# EAGLE design WS2811_Stepper (EAGLE 9.6.2)
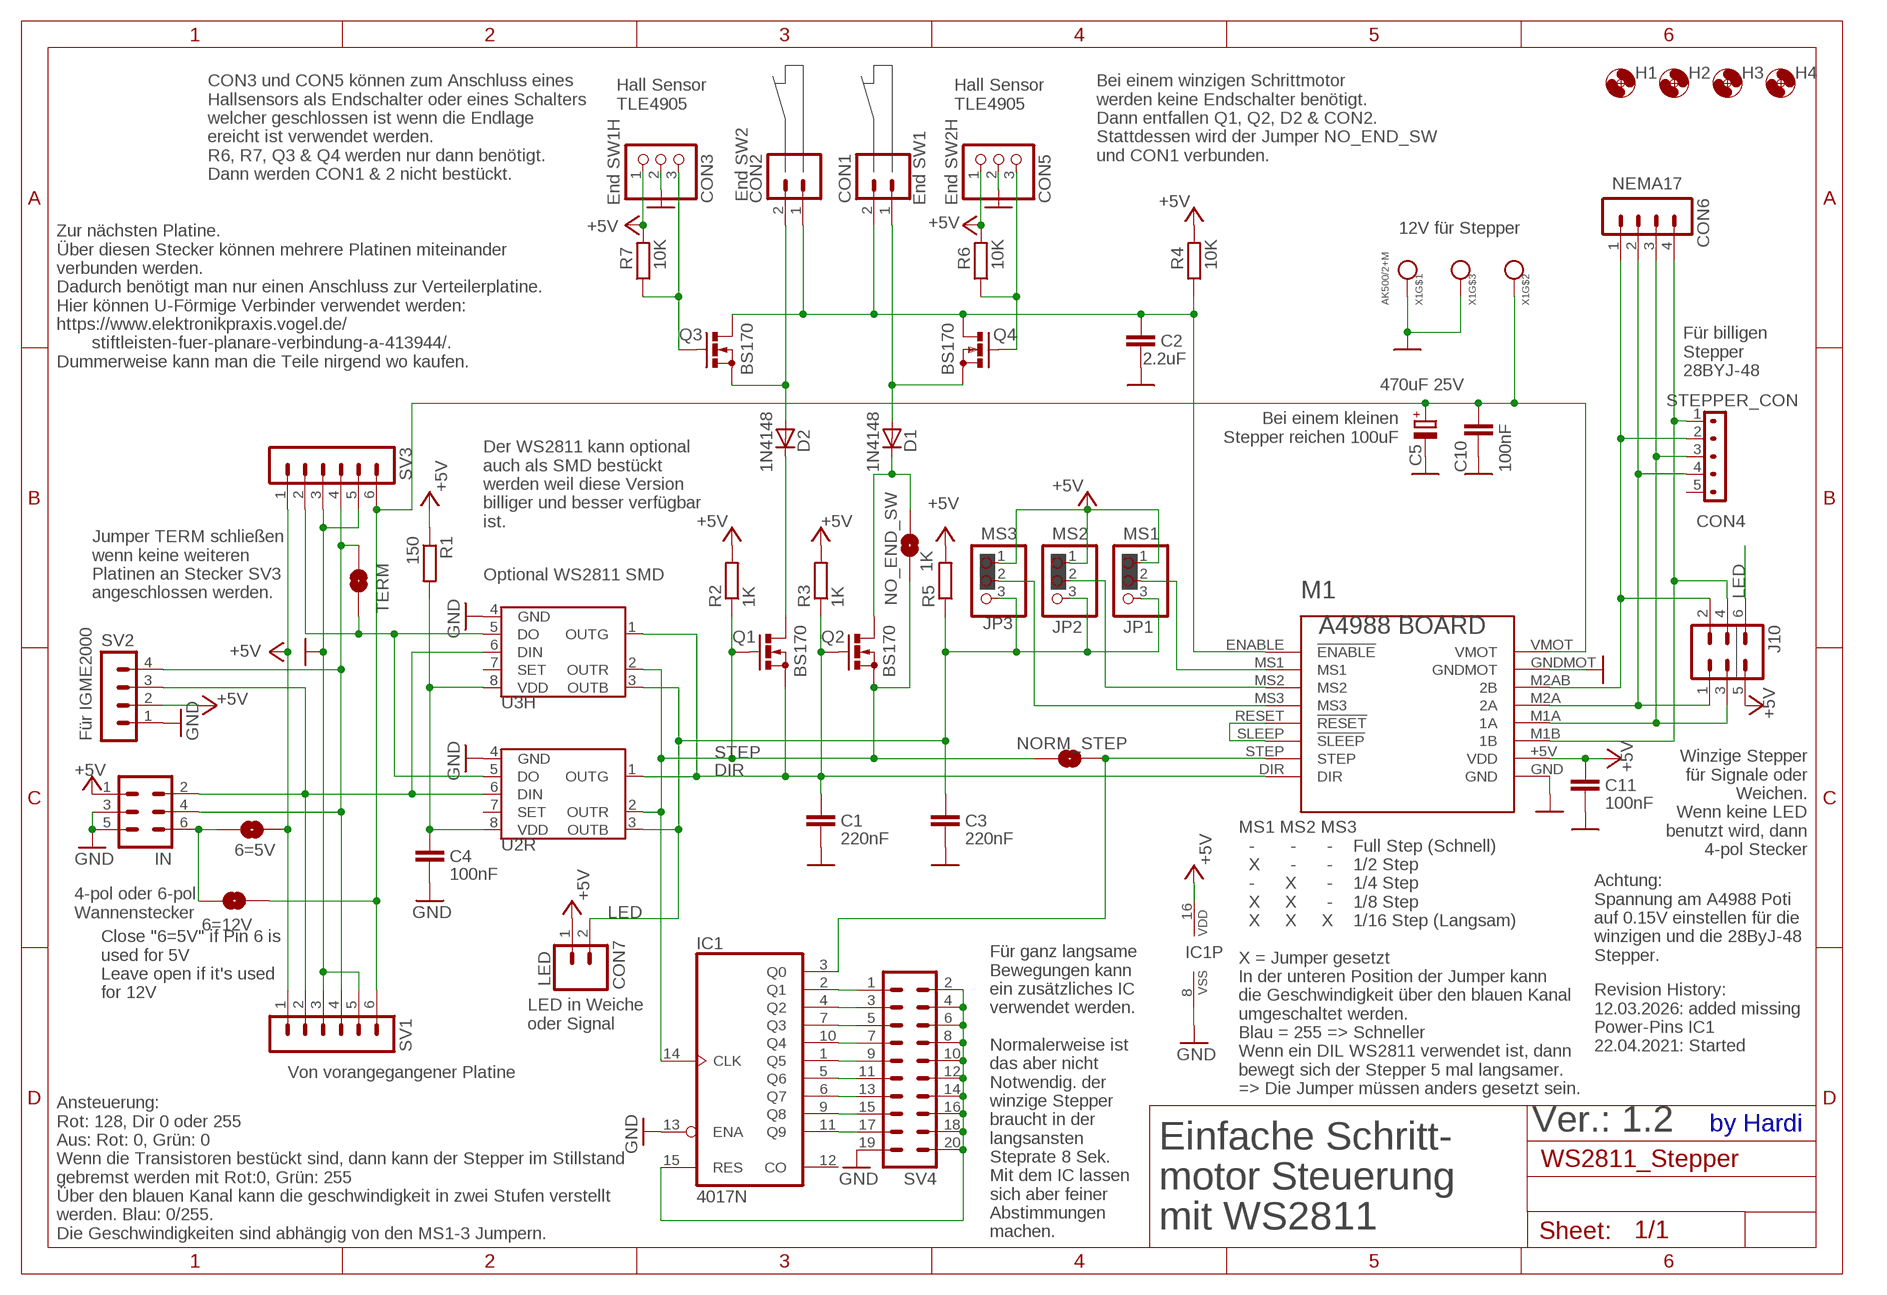
[diagram p0: schematic, sheet 1]

## Parts
6=5V  SOLDERJUMPERNO  [SJ_2S-NO]
6=12V  SOLDERJUMPERNO  [SJ_2S-NO]
C1  220nF  C-EU050-024X044  [C050-024X044]
C2  2.2uF  C-EU050-024X044  [C050-024X044]
C3  220nF  C-EU050-024X044  [C050-024X044]
C4  100nF  C-EU050-024X044  [C050-024X044]
C5  470uF 25V  CPOL-EUE5-10.5  [E5-10,5]
C10  100nF  C-EU050-024X044  [C050-024X044]
C11  100nF  C-EU050-024X044  [C050-024X044]
CON1  End SW1  M02PTH  [1X02]
CON2  End SW2  M02PTH  [1X02]
CON3  End SW1H  PINHD-1X3CB  [1X03-CLEANBIG]
CON4  STEPPER_CON  [STEPPER_CON]
CON5  End SW2H  PINHD-1X3CB  [1X03-CLEANBIG]
CON6  NEMA17  MA04-1  [MA04-1]
CON7  LED  M02PTH  [1X02]
D1  1N4148  1N4148DO35-7  [DO35-7]
D2  1N4148  1N4148DO35-7  [DO35-7]
H1  MOUNT-HOLE2.0  [2,0]
H2  MOUNT-HOLE2.0  [2,0]
H3  MOUNT-HOLE2.0  [2,0]
H4  MOUNT-HOLE2.0  [2,0]
IC1  4017N  [DIL16]
IN  ML6  [ML6]
J10  ML6  [ML6]
JP1  MS1  PINHD-1X3CB  [1X03-CLEANBIG]
JP2  MS2  PINHD-1X3CB  [1X03-CLEANBIG]
JP3  MS3  PINHD-1X3CB  [1X03-CLEANBIG]
M1  BOARD_A4988  [BOARD_A4988]
NO_END_SW  SOLDERJUMPERNO  [SJ_2S-NO]
NORM_STEP  SOLDERJUMPERNO  [SJ_2S-NO]
Q1  BS170  [SOT54E]
Q2  BS170  [SOT54E]
Q3  BS170  [SOT54E]
Q4  BS170  [SOT54E]
R1  150  RCL_R-EU_0204/7  [RCL_0204/7]
R2  1K  RCL_R-EU_0204/7  [RCL_0204/7]
R3  1K  RCL_R-EU_0204/7  [RCL_0204/7]
R4  10K  RCL_R-EU_0204/7  [RCL_0204/7]
R5  1K  RCL_R-EU_0204/7  [RCL_0204/7]
R6  10K  RCL_R-EU_0204/7  [RCL_0204/7]
R7  10K  RCL_R-EU_0204/7  [RCL_0204/7]
SV1  MA06-1  [MA06-1]
SV2  MA04-1  [MA04-1]
SV3  MA06-1  [MA06-1]
SV4  MA10-2  [MA10-2]
TERM  SOLDERJUMPERNO  [SJ_2S-NO]
U2R  WS2811  S3PO_MODUL_WS2811_SOUND_MP3-TF-16P_WS2811_AND_ATTINY_WS2811-ICTINY45-20-DIP  [S3PO_MODUL_WS2811_SOUND_MP3-TF-16P_WS2811_AND_ATTINY_WS2811_DIP08]
U3H  WS2811 SOT-8  S3PO_MODUL_WS2811_SOUND_MP3-TF-16P_WS2811_AND_ATTINY_WS2811-ICSOP8  [SOP8]
X1  AK500/2+M  [AK500/2+M]

## Nets
+5V: 6=5V.2 C11.1 CON3.1 CON5.1 CON7.1 IC1.16(VDD) IN.1 J10.5 JP1.1 JP2.1 JP3.1 M1.+5V(VDD) R1.1 R2.2 R3.2 R4.2 R5.2 R6.2 R7.2 SV1.1 SV2.2 SV3.1
DIR: C1.1 M1.DIR Q1.S Q2.G R3.1 U2R.1(OUTG) U3H.1(OUTG)
GND: C1.2 C2.2 C3.2 C4.2 C5.- C10.2 C11.2 CON3.2 CON5.2 IC1.8(VSS) IC1.13(ENA) IN.3 IN.5 M1.GND M1.GNDMOT SV1.3 SV1.5 SV2.1 SV3.3 SV3.5 SV4.19 U2R.4(GND) U3H.4(GND) X1.1 X1.M
LED: C3.1 CON7.2 J10.6 JP1.3 JP2.3 JP3.3 R5.1 U2R.3(OUTB) U3H.3(OUTB)
M1A: CON4.3 CON6.3 J10.3 M1.M1A(1A)
M1B: CON4.1 CON6.4 J10.4 M1.M1B(1B)
M2A: CON4.4 CON6.2 J10.1 M1.M2A(2A)
M2B: CON4.2 CON6.1 J10.2 M1.M2AB(2B)
N$1: M1.RESET(!RESET) M1.SLEEP(!SLEEP)
N$2: IN.2 SV1.2 SV2.3 U2R.6(DIN) U3H.6(DIN)
N$3: SV3.2 TERM.2 U2R.5(DO) U3H.5(DO)
N$4: IN.4 SV1.4 SV2.4 SV3.4 TERM.1
N$5: C4.1 R1.2 U2R.8(VDD) U3H.8(VDD)
N$6: C2.1 CON1.2 CON2.1 M1.ENABLE(!ENABLE) Q3.D Q4.D R4.1
N$8: CON1.1 D1.A Q4.S
N$9: CON2.2 D2.A Q3.S
N$10: CON5.3 Q4.G R6.1
N$11: D2.C Q1.D
N$13: D1.C NO_END_SW.1 Q2.D
N$14: JP2.2 M1.MS2
N$15: 6=5V.1 6=12V.2 IN.6
N$16: CON3.3 Q3.G R7.1
N$18: IC1.2(Q1) SV4.1
N$19: IC1.4(Q2) SV4.3
N$20: IC1.7(Q3) SV4.5
N$21: IC1.10(Q4) SV4.7
N$22: JP1.2 M1.MS1
N$23: IC1.1(Q5) SV4.9
N$24: IC1.5(Q6) SV4.11
N$25: IC1.6(Q7) SV4.13
N$26: IC1.9(Q8) SV4.15
N$27: JP3.2 M1.MS3
N$28: IC1.11(Q9) SV4.17
N$29: IC1.15(RES) SV4.2 SV4.4 SV4.6 SV4.8 SV4.10 SV4.12 SV4.14 SV4.16 SV4.18 SV4.20
N$33: IC1.3(Q0) M1.STEP NORM_STEP.2
STEP: IC1.14(CLK) NO_END_SW.2 NORM_STEP.1 Q1.G Q2.S R2.1 U2R.2(OUTR) U3H.2(OUTR)
VCC2: 6=12V.1 C5.+ C10.1 M1.VMOT SV1.6 SV3.6 X1.2
Unconnected: CON4.5 IC1.12(CO) U2R.7(SET) U3H.7(SET)

## Notes on the sheet
- CON3 und CON5 können zum Anschluss eines 
  Hallsensors als Endschalter oder eines Schalters
  welcher geschlossen ist wenn die Endlage
  ereicht ist verwendet werden. 
  R6, R7, Q3 & Q4 werden nur dann benötigt.
  Dann werden CON1 & 2 nicht bestückt.
- Bei einem winzigen Schrittmotor
  werden keine Endschalter benötigt.
  Dann entfallen Q1, Q2, D2 & CON2.
  Stattdessen wird der Jumper NO_END_SW
  und CON1 verbunden.
- Hall Sensor
  TLE4905
- Hall Sensor
  TLE4905
- 12V für Stepper
- Zur nächsten Platine. 
  Über diesen Stecker können mehrere Platinen miteinander
  verbunden werden.
  Dadurch benötigt man nur einen Anschluss zur Verteilerplatine.
  Hier können U-Förmige Verbinder verwendet werden: 
  https://www.elektronikpraxis.vogel.de/
         stiftleisten-fuer-planare-verbindung-a-413944/.
  Dummerweise kann man die Teile nirgend wo kaufen.
- Für billigen
  Stepper
  28BYJ-48
- Bei einem kleinen
  Stepper reichen 100uF
- Der WS2811 kann optional
  auch als SMD bestückt
  werden weil diese Version
  billiger und besser verfügbar
  ist.
- Optional WS2811 SMD
- Jumper TERM schließen 
  wenn keine weiteren
  Platinen an Stecker SV3 
  angeschlossen werden.
- Für IGME2000
- Winzige Stepper
  für Signale oder
  Weichen.
  Wenn keine LED
  benutzt wird, dann
  4-pol Stecker
- MS1 MS2 MS3
    -       -      -    Full Step (Schnell)
    X      -      -    1/2 Step
    -      X      -    1/4 Step
    X     X      -    1/8 Step
    X     X     X    1/16 Step (Langsam)
  
  X = Jumper gesetzt
  In der unteren Position der Jumper kann
  die Geschwindigkeit über den blauen Kanal
  umgeschaltet werden.
  Blau = 255 => Schneller
  Wenn ein DIL WS2811 verwendet ist, dann
  bewegt sich der Stepper 5 mal langsamer. 
  => Die Jumper müssen anders gesetzt sein.
- Achtung:
  Spannung am A4988 Poti
  auf 0.15V einstellen für die
  winzigen und die 28ByJ-48
  Stepper.
- 4-pol oder 6-pol 
  Wannenstecker
- Für ganz langsame
  Bewegungen kann 
  ein zusätzliches IC
  verwendet werden.
  
  Normalerweise ist
  das aber nicht 
  Notwendig. der 
  winzige Stepper
  braucht in der
  langsansten 
  Steprate 8 Sek.
  Mit dem IC lassen
  sich aber feiner
  Abstimmungen 
  machen.
- Close "6=5V" if Pin 6 is
  used for 5V
  Leave open if it's used 
  for 12V
- LED in Weiche
  oder Signal
- Revision History:
  12.03.2026: added missing 
  Power-Pins IC1
  22.04.2021: Started
- Von vorangegangener Platine
- Ansteuerung: 
  Rot: 128, Dir 0 oder 255
  Aus: Rot: 0, Grün: 0
  Wenn die Transistoren bestückt sind, dann kann der Stepper im Stillstand
  gebremst werden mit Rot:0, Grün: 255
  Über den blauen Kanal kann die geschwindigkeit in zwei Stufen verstellt
  werden. Blau: 0/255.
  Die Geschwindigkeiten sind abhängig von den MS1-3 Jumpern.
- Ver.: 1.2 | by Hardi
- Einfache Schritt-
  motor Steuerung
  mit WS2811

## Library data of the parts
6=5V 6=12V NO_END_SW NORM_STEP TERM = SparkFun-Retired:SOLDERJUMPER: Solder Jumper Standard SMD solder jumper. Used to automate production. Two varients : Normally Open and Normally Closed are the same, but have different paste layers. NC will have a large amount of paste and should jumper during reflow.
C1-C4 C10 C11 = resistor:C-EU: CAPACITOR, European symbol
C5 = resistor:CPOL-EU: POLARIZED CAPACITOR, European symbol
CON1 CON2 CON7 = SparkFun-Connectors:M02: Standard 2-pin 0.1" header. Use with - straight break away headers ( PRT-00116) - right angle break away headers (PRT-00553) - swiss pins (PRT-00743) - machine pins (PRT-00117) - female headers (PRT-00115) Molex polarized connector foot print use with: PRT-08233 with associated crimp pins and housings. 2.54_SCREWTERM for use with PRT-10571. 3.5mm Screw Terminal footprints for PRT-08084 5mm Screw Terminal footprints for use with PRT-08432
CON3 CON5 JP1-JP3 = adafruit:PINHD-1X3: PIN HEADER
CON4 = Connectors_Inline3_7:STEPPER_CON
CON6 SV2 = con-lstb:MA04-1: PIN HEADER; OC_FARNELL: unknown; OC_NEWARK: unknown
D1 D2 = diode:1N4148: DIODE high speed (Philips)
H1-H4 = holes:MOUNT-HOLE: MOUNTING HOLE with drill center marker
IC1 = 40xx:4017: COUNTER/DIVIDER
IN J10 = con-harting-ml:ML6: HARTING; OC_FARNELL: unknown; OC_NEWARK: unknown
M1 = Clean-Kong:BOARD_A4988
Q1-Q4 = transistor-small-signal:BS170: N-CHANNEL MOS FET
R1-R7 = Sound_MP3-TF-16P_and_WS2811:RCL_R-EU_: RESISTOR, European symbol; SPICEPREFIX: R
SV1 SV3 = con-lstb:MA06-1: PIN HEADER; OC_FARNELL: unknown; OC_NEWARK: unknown
SV4 = con-lstb:MA10-2: PIN HEADER; OC_FARNELL: unknown; OC_NEWARK: unknown
U2R = S3PO_Modul_WS2811:S3PO_MODUL_WS2811_SOUND_MP3-TF-16P_WS2811_AND_ATTINY_WS2811-IC: Die Pin Nummern für R und G sind getauscht damit sie gleich angesteuert werden wie die WS2812. Der Daten Strom der WS2811 ist RGB, Beim WS2812 ist es aber GRB.; PROD_ID: IC-09439; VALUE: TINY45-20-DIP
U3H = S3PO_Modul_WS2811:S3PO_MODUL_WS2811_SOUND_MP3-TF-16P_WS2811_AND_ATTINY_WS2811-IC: Die Pin Nummern für R und G sind getauscht damit sie gleich angesteuert werden wie die WS2812. Der Daten Strom der WS2811 ist RGB, Beim WS2812 ist es aber GRB.
X1 = Arduino_fuer_LEDs_DCC_2:AK500/2+M

## Board
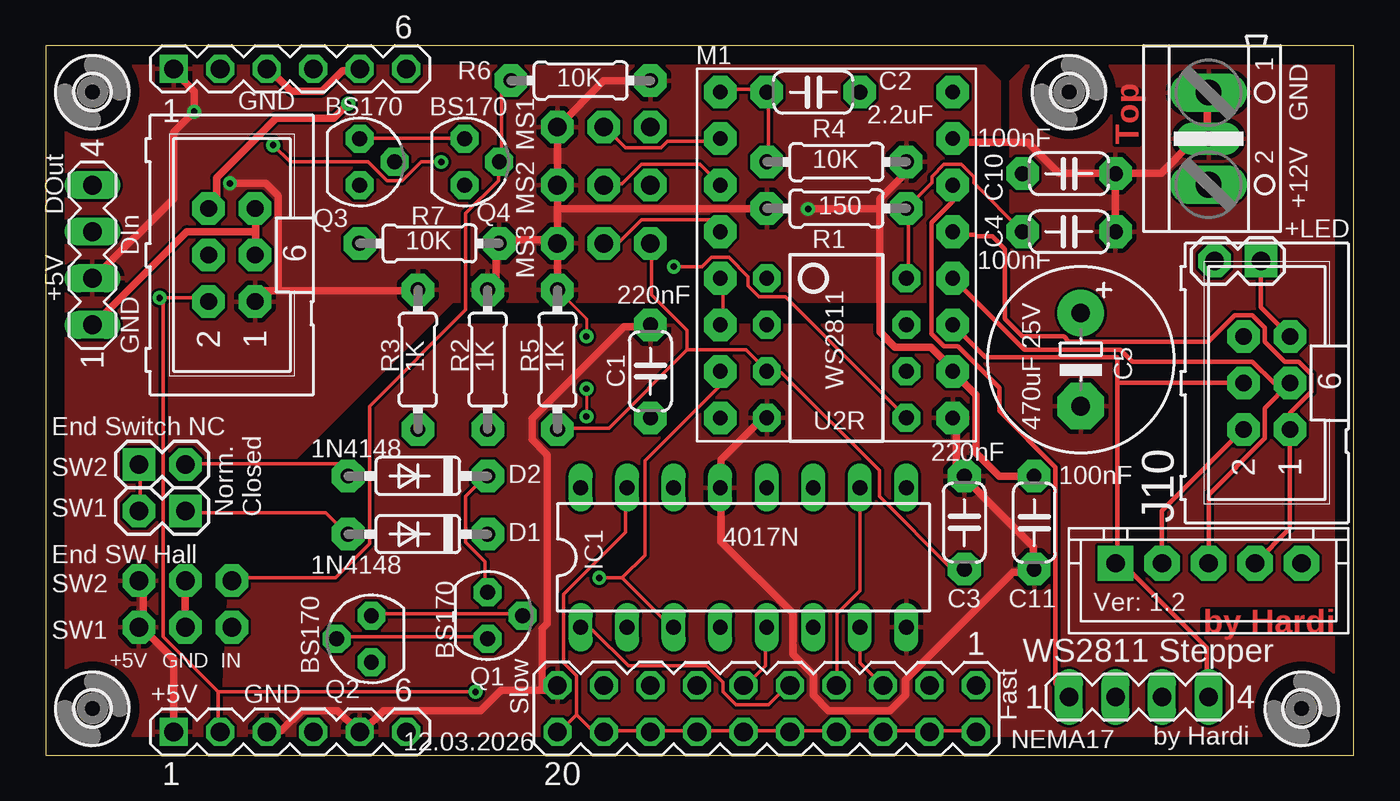
[diagram p1: board, top side]
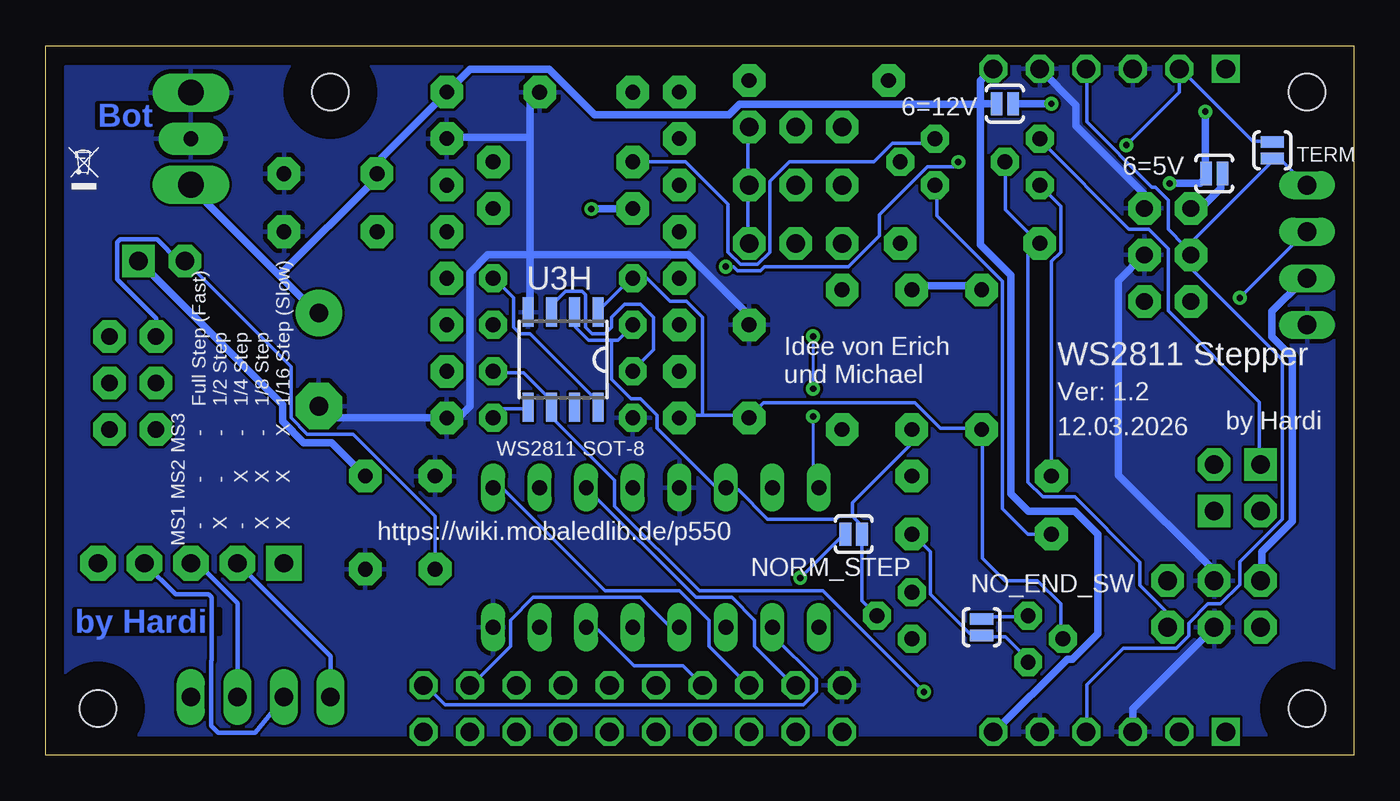
[diagram p2: board, bottom side, seen from below]

Size 71.42 x 38.73 mm. Coordinates in mm from the lower left corner, seen from the top.
Outline: 0,0 71.42,0 71.42,38.73 0,38.73 0,0
Copper layers (1*16): Top 0.035mm / dielectric 1.5mm / Bottom 0.035mm
Design rules "default *": minimum track width 6mil, minimum drill 0.35mm, track to track 6mil, track to pad 6mil, pad to pad 6mil, via to via 6mil, smd to smd 6mil, copper to edge 40mil, drill to drill 6mil, minimum pad ring 10mil, minimum via ring 8mil, stop-mask expansion 4mil, vias tented up to drill 14mil, thermal gap 10mil

### Footprints (pad centres in the part's own frame; a part is rotated, then mirrored left to right if it is on the bottom)
SJ_2S-NO = smd 0.635 x 1.27: 1 -0.45,0; 2 0.45,0
C050-024X044 = drill 0.813 pad 1.778 octagon: 1 -2.54,0; 2 2.54,0
E5-10,5 = drill 1.016 pad 2.54: + -2.54,0 | drill 1.016 pad 2.54 octagon: - 2.54,0
1X02 = drill 1.016 pad 1.778 square: 1 0,0 | drill 1.016 pad 1.778 octagon: 2 2.54,0
1X03-CLEANBIG = drill 1.016 pad 1.778 octagon: 1 -2.54,0; 2 0,0; 3 2.54,0
STEPPER_CON = drill 1 pad 1.93 square: 1 0,0 | drill 1 pad 1.93 octagon: 2 2.54,0; 3 5.08,0; 4 7.62,0; 5 10.16,0
MA04-1 = drill 1.016 long: 1 -3.81,0; 2 -1.27,0; 3 1.27,0; 4 3.81,0
DO35-7 = drill 0.813 pad 1.778 octagon: A 3.81,0; C -3.81,0
2,0 = hole 2: 0,0
DIL16 = drill 0.813 long: 1 -8.89,-3.81; 2 -6.35,-3.81; 3 -3.81,-3.81; 4 -1.27,-3.81; 5 1.27,-3.81; 6 3.81,-3.81; 7 6.35,-3.81; 8 8.89,-3.81; 9 8.89,3.81; 10 6.35,3.81; 11 3.81,3.81; 12 1.27,3.81; 13 -1.27,3.81; 14 -3.81,3.81; 15 -6.35,3.81; 16 -8.89,3.81
ML6 = drill 0.914 pad 1.778 octagon: 1 -2.54,-1.27; 2 -2.54,1.27; 3 0,-1.27; 4 0,1.27; 5 2.54,-1.27; 6 2.54,1.27
BOARD_A4988 = drill 0.8 pad 1.778 octagon: +5V 1.27,16.51; DIR 13.97,19.05; ENABLE 13.97,1.27; GND 1.27,19.05; GNDMOT 1.27,3.81; M1A 1.27,11.43; M1B 1.27,13.97; M2A 1.27,8.89; M2AB 1.27,6.35; MS1 13.97,3.81; MS2 13.97,6.35; MS3 13.97,8.89; RESET 13.97,11.43; SLEEP 13.97,13.97; STEP 13.97,16.51; VMOT 1.27,1.27
SOT54E = drill 0.813 pad 1.524 octagon: D -1.27,0; G 0,1.905; S 1.27,0
RCL_0204/7 = drill 0.813 pad 1.778 octagon: 1 -3.81,0; 2 3.81,0
MA06-1 = drill 1.016 pad 1.524 square: 1 -6.35,0 | drill 1.016 pad 1.524 octagon: 2 -3.81,0; 3 -1.27,0; 4 1.27,0; 5 3.81,0; 6 6.35,0
MA10-2 = drill 1.016 octagon: 1 -11.43,-1.27; 2 -11.43,1.27; 3 -8.89,-1.27; 4 -8.89,1.27; 5 -6.35,-1.27; 6 -6.35,1.27; 7 -3.81,-1.27; 8 -3.81,1.27; 9 -1.27,-1.27; 10 -1.27,1.27; 11 1.27,-1.27; 12 1.27,1.27; 13 3.81,-1.27; 14 3.81,1.27; 15 6.35,-1.27; 16 6.35,1.27; 17 8.89,-1.27; 18 8.89,1.27; 19 11.43,-1.27; 20 11.43,1.27
S3PO_MODUL_WS2811_SOUND_MP3-TF-16P_WS2811_AND_ATTINY_WS2811_DIP08 = drill 0.813 pad 1.524 octagon: 1 -3.81,-3.81; 2 -1.27,-3.81; 3 1.27,-3.81; 4 3.81,-3.81; 5 3.81,3.81; 6 1.27,3.81; 7 -1.27,3.81; 8 -3.81,3.81
SOP8 = smd 0.6 x 1.6: 1 -1.905,-2.6; 2 -0.635,-2.6; 3 0.635,-2.6; 4 1.905,-2.6; 5 1.905,2.6; 6 0.635,2.6; 7 -0.635,2.6; 8 -1.905,2.6
AK500/2+M = drill 1.397 long: 1 -2.515,0; 2 2.515,0 | drill 0.813 pad 1.778 long: M 0,0

### Placement (x,y rotation side)
6=5V  7.62,31.75 180 bottom
6=12V  19.05,35.56 0 bottom
C1  33.02,20.95 90 top
C2  41.91,36.2 0 top
C3  50.16,12.7 90 top
C4  55.88,28.57 0 top
C5  56.52,21.59 270 top
C10  55.88,31.75 0 top
C11  53.98,12.7 270 top
CON1  7.62,13.34 180 top
CON2  5.08,15.88 0 top
CON3  7.62,6.99 0 top
CON4  58.42,10.48 0 top
CON5  7.62,9.53 0 top
CON6  59.69,3.17 0 top
CON7  66.36,26.99 180 top
D1  20.32,12.06 180 top
D2  20.32,15.24 180 top
H1  68.58,2.54 0 top
H2  2.54,36.2 0 top
H3  2.54,2.54 0 top
H4  55.88,36.2 0 top
IC1  38.1,10.79 0 top
IN  10.16,27.3 90 top
J10  66.67,20.32 90 top
JP1  30.48,34.29 0 top
JP2  30.48,31.11 0 top
JP3  30.48,27.94 0 top
M1  50.8,37.47 180 top
NO_END_SW  20.32,6.99 90 bottom
NORM_STEP  27.3,12.06 180 bottom
Q1  24.13,7.62 270 top
Q2  17.78,6.35 90 top
Q3  17.14,32.38 270 top
Q4  22.86,32.38 270 top
R1  43.18,29.84 0 top
R2  24.13,21.59 90 top
R3  20.32,21.59 90 top
R4  43.18,32.38 0 top
R5  27.94,21.59 90 top
R6  29.21,36.83 0 top
R7  20.95,27.94 0 top
SV1  13.34,1.27 0 top
SV2  2.54,27.3 90 top
SV3  13.34,37.47 0 top
SV4  39.37,2.54 180 top
TERM  4.45,33.02 90 bottom
U2R  43.18,22.23 270 top
U3H  43.18,21.59 180 bottom
X1  63.5,33.66 270 top

### Tracks (layer width: path | path; a pad name or v marks a point on that pad's centre or on a via)
+5V  (via drill 0.35)
  Top 0.152: R5.2 29.53,23.81 v29.53,22.86 | v29.53,20 v29.53,18.49
  Top 0.254: J10.5 66.36,24.45 CON7.1
  Top 0.406: SV1.1 6.99,5.23 5.31,6.91 CON3.1 5.31,7.19 5.31,9.42 CON5.1 | SV3.1 6.99,37.36 8.1,36.25 v8.1,35.13 6.99,34.01 6.99,30.38 2.79,26.19 SV2.2 | v10.06,31.22 12.01,31.22 12.7,30.53 12.7,25.35 | 45.54,29.82 45.54,23.11 46.38,22.28 48.34,22.28 49.45,21.16 M1.+5V 50.8,19.68 50.8,16.51 52.07,15.24 C11.1 | 45.54,29.82 45.54,30.38 46.94,31.77 46.94,32.33 R4.2 | R2.2 24.31,25.63 24.59,25.91 24.59,27.86 R7.2 24.87,28.14 27.94,28.14 | R5.2 JP3.1 27.94,28.14 | 27.94,28.14 27.94,29.82 | 27.94,29.82 JP2.1 JP1.1 30.45,36.8 32.97,36.8 R6.2 | 27.94,29.82 39.12,29.82 R1.1 | v41.63,29.82 45.54,29.82 | R3.2 20.12,25.35 12.7,25.35 | 12.7,25.35 12.01,25.35 IN.1
  Bottom 0.152: v29.53,22.86 v29.53,20 | v29.53,18.49 29.53,14.92 IC1.16
  Bottom 0.406: v8.1,35.13 8.1,31.77 6=5V.2 8.1,31.5 8.38,31.22 v10.06,31.22 | CON5.1 5.03,9.7 5.03,11.1 3.35,12.78 3.35,21.72 4.47,22.84 4.47,24.23 2.79,25.91 SV2.2 | R3.2 20.4,25.63 24.03,25.63 R2.2 | v41.63,29.82 39.4,29.82 R1.1 | C11.1 55.8,17.07 57.34,17.07 58.5,18.23 58.5,19.13 CON7.1
  pour Top: 0,0 0,38.1 50.8,38.1 52.07,36.83 52.07,26.67 50.16,24.77 22.23,24.77 8.89,11.43 8.89,0
DIR
  Top 0.203: Q2.G 16,6.48 24,6.48 Q1.S
  Bottom 0.203: U3H.1 41.25,24.26 39.47,26.04 U2R.1 38.58,26.04 37.34,24.79 36.45,24.79 35.56,23.9 35.56,18.57 | 35.56,18.57 33.07,18.57 C1.1 32.89,18.57 32.22,19.24 23.96,19.24 22.58,17.86 20.45,17.86 R3.1 20.27,17.68 20.27,10.74 19.05,9.53 17.27,9.53 16,8.26 16,6.48 Q2.G | 35.56,18.57 36.8,18.57 M1.DIR
GND
  Top 0.406: 11.46,28.57 11.46,29.82 IN.5 | 11.46,28.57 11.46,27.3 IN.3 | SV2.1 2.79,23.67 7.7,28.57 11.46,28.57 | SV3.5 17.04,37.36 16.2,37.36 15.09,36.25 13.41,36.25 12.29,37.36 SV3.3 | U2R.4 39.12,18.36 36.88,16.13 36.88,14.73 IC1.13 36.88,14.45 36.88,11.66 40.79,7.75 40.79,5.51 41.91,4.39 41.91,3.28 42.75,2.44 46.1,2.44 46.94,3.28 46.94,4.12 52.81,9.98 53.92,9.98 C11.2 53.92,10.26 53.92,11.38 50.29,15.01 C3.2 50.01,15.29 49.73,15.57 49.73,18.36 M1.GND | SV1.3 12.29,1.32 12.85,1.32 13.97,2.44 15.93,2.44 17.04,1.32 SV1.5 17.32,1.32 18.44,2.44 23.75,2.44 24.87,3.56 27.1,3.56 | 27.1,3.56 27.94,3.56 SV4.19 | C4.2 58.4,28.7 58.4,31.5 C10.2 | X1.1 63.42,35.97 63.42,33.73 X1.M 63.42,33.45 62.59,33.45 60.91,31.77 58.67,31.77 C10.2 | C10.2 58.4,31.77 55.32,31.77 53.65,33.45 49.73,33.45 M1.GNDMOT | 27.1,3.56 27.1,6.91 27.38,7.19 27.38,16.41 26.54,17.25 26.54,18.36 31.57,23.39 32.97,23.39 C1.2 | CON3.2 CON5.2
  Bottom 0.406: IN.3 11.46,27.3 12.85,25.91 12.85,15.29 7.62,10.06 CON5.2 | IN.5 11.46,30.1 11.46,30.66 15.16,34.37 15.16,35.48 SV3.5 | 44.98,33.73 44.98,35.69 44.7,35.97 C2.2 | 44.98,33.73 44.98,27.3 | 44.98,27.3 44.98,24.23 U3H.4 | 44.98,27.3 36.32,27.3 33.25,24.23 33.25,23.67 C1.2 | 44.98,33.73 49.45,33.73 M1.GNDMOT | CON3.2 12.06,2.54 SV1.3 | C5.- 55.88,18.41 M1.GND 48.9,18.41 48.26,19.05 48.26,26.35 47.3,27.3 44.98,27.3
  pour Top: 9.53,0 10.16,11.43 22.23,23.5 49.85,23.5 52.7,26.35 52.7,36.83 53.98,38.1 71.12,38.1 71.12,0
  pour Bottom: 1.27,0 0,1.27 0,36.83 1.27,38.1 69.85,38.1 71.12,36.83 71.12,1.27 69.85,0
LED
  Top 0.203: C3.1 50.14,10.21 49.43,10.21 45.52,14.12 45.52,15.54 40.18,20.88 39.47,20.88 U2R.3 39.29,21.06 38.23,22.12 35.03,22.12 | 35.03,22.12 30.76,17.86 28.09,17.86 R5.1 | 35.03,22.12 35.03,23.19 33.07,25.15 33.07,27.81 JP3.3
  Bottom 0.203: JP3.3 33.07,27.99 33.07,31.01 JP2.3 33.07,31.19 33.07,34.21 JP1.3 | U3H.3 43.74,24.26 43.74,24.61 43.03,25.32 42.14,25.32 41.96,25.15 41.96,23.37 41.6,23.01 40.89,23.01 40.54,23.37 40.54,23.9 39.83,24.61 38.94,24.61 38.23,23.9 38.23,22.12 39.29,21.06 U2R.3 | CON7.2 58.04,21.21 58.04,18.42 57.15,17.53 54.65,17.53 50.16,13.05 C3.1
  Bottom 0.254: CON7.2 64.18,26.99 65.35,28.16 67.36,28.16 67.53,27.99 67.53,25.98 65.41,23.86 J10.6
M1A
  Top 0.254: M1.M1A 53.44,22.12 58.69,22.12 59.33,21.49 65.89,21.49 67.06,20.32 J10.3 66.57,18.95 66.57,17.3 63.5,14.22 CON4.3
  Bottom 0.254: CON6.3 60.96,8.31 63.13,10.48 CON4.3
M1B
  Top 0.254: CON6.4 63.4,3.25 63.4,5.87 59.16,10.11 CON4.1 58.52,10.63 58.52,20.32 | 58.52,20.32 58.52,21.72 51.31,21.72 M1.M1B | J10.4 58.52,20.32
M2A
  Top 0.254: M1.M2A 49.58,28.42 50.77,28.42 50.87,28.32 51.69,28.32 52.39,27.62 52.39,23.81 53.34,22.86 55.59,22.86 55.87,22.58 63.47,22.58 64.92,24.03 65.89,24.03 66.57,23.34 66.57,22.58 67.66,21.49 68.43,21.49 69.11,20.8 69.11,19.84 67.94,18.67 J10.1 67.94,12.38 CON4.4
  Bottom 0.254: CON6.2 59.98,1.22 62,1.22 62.38,1.6 62.38,5.16 62.36,5.18 62.36,8.61 62.52,8.78 64.34,8.78 CON4.4
M2B
  Top 0.254: M1.M2AB 49.53,30.23 48.36,29.06 48.36,23.01 49.05,22.33 49.81,22.33 52.07,20.07 52.07,18.8 55.14,15.72 55.14,3.91 CON6.1 | CON4.2 60.96,13.34 J10.2
  Bottom 0.254: CON4.2 55.88,5.4 CON6.1
N$1
  Top 0.203: M1.SLEEP 36.98,23.55 36.98,26.04 M1.RESET
N$2  (via drill 0.35)
  Top 0.203: 6.4,24.97 8.71,24.97 8.89,24.79 IN.2 | 9.42,3.45 9.42,1.32 SV1.2 | 9.42,3.45 6.4,6.48 6.4,24.97 | 6.4,24.97 v6.22,24.97 | 9.42,3.45 v23.47,3.45
  Bottom 0.203: U2R.6 46.94,20.88 45.34,20.88 43.92,19.46 43.92,19.1 U3H.6 43.74,18.92 43.74,18.39 40.36,15.01 40.36,13.59 35.74,8.97 28.98,8.97 v23.47,3.45 | v6.22,24.97 2.67,28.52 SV2.3
N$3  (via drill 0.35)
  Top 0.203: v34.29,26.67 35.85,26.67 36.36,27.18 37.3,27.18 38.35,26.13 38.35,25.61 38.95,25.02 40.39,25.02 U2R.5 | v12.42,33.3 13.34,32.38 17.61,32.38 18.63,31.37 19.47,31.37 20.49,32.38 v21.59,32.38
  Bottom 0.203: U3H.5 45.16,18.92 46.58,18.92 46.94,18.57 U2R.5 | TERM.2 4.45,33.5 5.51,33.5 9.42,37.41 SV3.2 9.53,36.2 v12.42,33.3 | v34.29,26.67 33.87,26.67 33.64,26.44 32.4,26.44 32.17,26.67 27.59,26.67 25.91,28.36 25.91,29.5 23.28,32.13 21.84,32.13 v21.59,32.38
N$4
  Bottom 0.203: 4.45,32.44 3.91,32.44 2.67,31.19 SV2.4 | IN.4 8.89,26.57 3.91,21.59 3.91,12.88 6.22,10.57 6.22,9.31 7.27,8.26 7.97,8.26 9.02,7.2 9.02,6.51 9.69,5.84 12.57,5.84 14.58,3.83 14.58,1.32 SV1.4 | 9.25,27.81 8.89,27.46 IN.4 | 9.25,27.81 10.13,28.7 10.13,30.3 10.85,31.01 11.02,31.01 14.58,34.57 14.58,37.41 SV3.4 | 4.45,32.44 9.07,27.81 9.25,27.81 | 4.45,32.44 TERM.1 | 9.25,27.81 IN.4
N$5
  Top 0.203: U2R.8 47.12,26.04 47.12,29.77 R1.2 48.39,31.24 48.39,31.59 49.06,32.26 50,32.26 50.67,31.59 50.67,31.24 C4.1
  Bottom 0.203: U3H.8 41.43,19.1 41.43,19.46 44.98,23.01 45.52,23.01 45.87,23.37 45.87,24.97 46.94,26.04 U2R.8
N$6
  Top 0.203: R4.1 39.47,32.44 39.47,36.17 C2.1 39.29,36.35 36.98,36.35 M1.ENABLE | CON1.2 5.16,13.41 5.16,15.72 CON2.1 | Q3.D 17.25,33.68 22.76,33.68 Q4.D
  Bottom 0.203: CON2.1 5.16,15.9 5.16,19.28 10.13,24.26 10.13,27.64 11.2,28.7 12.27,28.7 17.07,33.5 Q3.D | Q4.D 23.11,33.4 25.19,33.4 26.2,32.38 30.83,32.38 31.88,31.33 31.88,27.47 32.55,26.8 33.49,26.8 34.16,27.47 34.16,30.06 36.48,32.38 R4.1
N$8
  Top 0.203: CON1.1 7.64,13.23 15.29,13.23 16.36,12.17 D1.A
  Bottom 0.203: Q4.S 22.76,31.01 22.76,29.45 19.18,25.87 19.18,13.46 17.78,12.06 D1.A
N$9
  Top 0.203: 16,15.9 16,15.72 16.36,15.37 D2.A 16,15.9 | 16,15.9 7.64,15.9 CON2.2
  Bottom 0.203: D2.A 16.51,26.96 16,27.47 16,29.97 Q3.S
N$10
  Top 0.203: R6.1 25.25,36.7 24.89,36.35 24.89,32.44 Q4.G 24.71,32.26 24.71,31.37 22.94,29.59 22.94,24.31 17.68,19.05 17.68,11.53 15.82,9.68 10.31,9.68 CON5.3
N$11
  Top 0.203: Q1.D 24,8.97 24,10.57 22.94,11.63 22.94,14.12 24,15.19 D2.C
N$13
  Bottom 0.203: Q2.D 17.78,5.23 19.02,6.48 20.27,6.48 NO_END_SW.1 20.45,6.66 20.98,6.66 23.11,8.79 23.11,11.1 24,11.99 D1.C
N$14
  Top 0.203: JP2.2 30.58,31.19 31.47,31.19 32.54,32.26 35.74,32.26 36.8,31.19 M1.MS2
N$15  (via drill 0.35)
  Top 0.406: v16.51,35.56 15.72,34.77 12.58,34.77 9.32,31.52 9.32,30.28 IN.6
  Bottom 0.406: 6=5V.1 7.26,31.5 7.26,30.94 8.1,30.1 8.66,30.1 IN.6 | 6=12V.2 v16.51,35.56
N$16
  Bottom 0.203: Q3.G 19.02,32.26 19.02,29.77 17.25,27.99 R7.1 17.78,27.3 17.78,14.89 16.98,14.1 15.24,14.1 11.68,10.54 11.68,9.27 10.31,7.9 10.31,7.01 CON3.3
N$18
  Bottom 0.203: IC1.2 31.65,6.83 31.65,6.48 29.34,4.17 29.34,3.45 30.05,2.74 49.61,2.74 50.67,3.81 SV4.1
N$19
  Bottom 0.203: IC1.4 36.98,7.01 37.34,7.01 38.94,8.61 44.81,8.61 46.05,7.37 46.05,5.94 48.18,3.81 SV4.3
N$20
  Top 0.203: IC1.7 44.45,5.05 45.7,3.81 SV4.5
N$21
  Top 0.203: IC1.10 44.45,8.97 43.2,7.72 43.2,3.81 SV4.7
N$22
  Top 0.203: M1.MS1 36.8,33.5 33.96,33.5 33.6,33.15 31.65,33.15 30.58,34.21 JP1.2
N$23
  Top 0.203: IC1.1 29.34,6.83 29.87,6.83 31.83,4.88 36.09,4.88 36.98,3.99 36.98,3.45 37.69,2.74 39.47,2.74 40.54,3.81 SV4.9
N$24
  Top 0.203: IC1.5 39.29,6.83 39.29,4.88 38.23,3.81 SV4.11
N$25
  Bottom 0.203: SV4.13 36.63,4.88 39.29,4.88 41.25,6.83 41.78,6.83 IC1.6
N$26
  Bottom 0.203: IC1.9 46.94,14.48 46.41,14.48 40.89,8.97 36.8,8.97 35.2,7.37 35.2,5.94 33.07,3.81 SV4.15
N$27
  Top 0.203: JP3.2 30.58,27.99 31.29,27.99 32.54,29.23 36.27,29.23 36.8,28.7 M1.MS3
N$28
  Bottom 0.203: IC1.11 35.92,8.61 33.96,8.61 32.72,7.37 32.72,5.94 30.58,3.81 SV4.17
N$29
  Top 0.203: SV4.2 50.67,1.32 48.36,1.32 SV4.4 48.18,1.32 45.87,1.32 SV4.6 45.7,1.32 43.2,1.32 SV4.8 43.03,1.32 40.72,1.32 SV4.10 40.54,1.32 38.23,1.32 SV4.12 38.05,1.32 35.56,1.32 | 28.98,2.21 28.98,4.34 28.27,5.05 28.27,8.79 31.65,12.17 31.65,14.48 IC1.15 | 28.98,2.21 28.09,1.32 SV4.20 | 28.98,2.21 29.87,1.32 30.4,1.32 SV4.18 30.58,1.32 32.89,1.32 SV4.16 33.07,1.32 35.56,1.32 | 35.56,1.32 SV4.14
N$33  (via drill 0.35)
  Top 0.203: 31.47,9.68 v30.23,9.68 | 31.47,9.68 34.14,7.01 IC1.3 | 31.47,9.68 32.72,10.92 32.72,16.08 36.8,20.17 36.8,20.88 M1.STEP
  Bottom 0.203: v30.23,9.68 27.91,11.99 NORM_STEP.2
STEP
  Top 0.203: Q2.S 17.78,7.72 25.96,7.72 Q1.G
  Bottom 0.203: 40.54,22.66 40.18,22.66 39.47,23.37 U2R.2 | 40.54,22.66 41.78,22.66 42.49,23.37 42.49,24.08 U3H.2 | NO_END_SW.2 20.27,7.54 17.78,7.54 Q2.S | Q1.G 26.85,8.43 26.85,11.99 NORM_STEP.1 27.03,12.17 27.03,12.7 27.38,13.06 | 27.38,13.06 28.09,13.06 28.27,12.88 32,12.88 33.6,14.48 34.14,14.48 IC1.14 34.31,14.66 34.85,14.66 38.05,17.86 38.05,18.57 38.94,19.46 39.47,19.46 40.54,20.52 40.54,22.66 | 27.38,13.06 27.38,13.77 24.18,16.97 24.18,17.68 R2.1
VCC2
  Bottom 0.406: SV3.6 19.84,37.36 20.4,36.8 20.4,35.56 | 20.4,35.56 20.4,27.88 18.72,26.2 18.72,14.28 17.75,13.31 15.21,13.31 13.97,12.06 13.97,6.63 15.37,5.23 15.65,5.23 19.56,1.32 SV1.6 | 58.67,26.19 56.72,24.23 C5.+ | 58.67,26.19 63.42,30.94 X1.2 | 58.67,26.19 53.37,31.5 C10.1 53.09,31.77 53.09,32.61 49.73,35.97 M1.VMOT 49.45,36.25 48.26,37.44 43.93,37.44 41.45,34.95 34.12,34.95 33.54,35.53 20.42,35.53 20.4,35.56 | 6=12V.1 20.4,35.56

### Text on the board
Top: Top | by Hardi
Bottom: Bot | by Hardi
tNames: GND | GND | DOut | +12V | +LED | DIn | +5V | GND | End Switch NC | SW2 | SW1 | Norm. / Closed | End SW Hall | SW2 | SW1 | +5V | GND | IN | WS2811 Stepper | +5V | GND | Slow | Fast | by Hardi
bNames: WS2811 Stepper | Idee von Erich / und Michael | Full Step (Fast) / 1/2 Step / 1/4 Step / 1/8 Step / 1/16 Step (Slow) | by Hardi | MS3 / - / - / - / - / X | MS2 / - / - / X / X / X | https://wiki.mobaledlib.de/p550 | MS1 / - / X / - / X / X